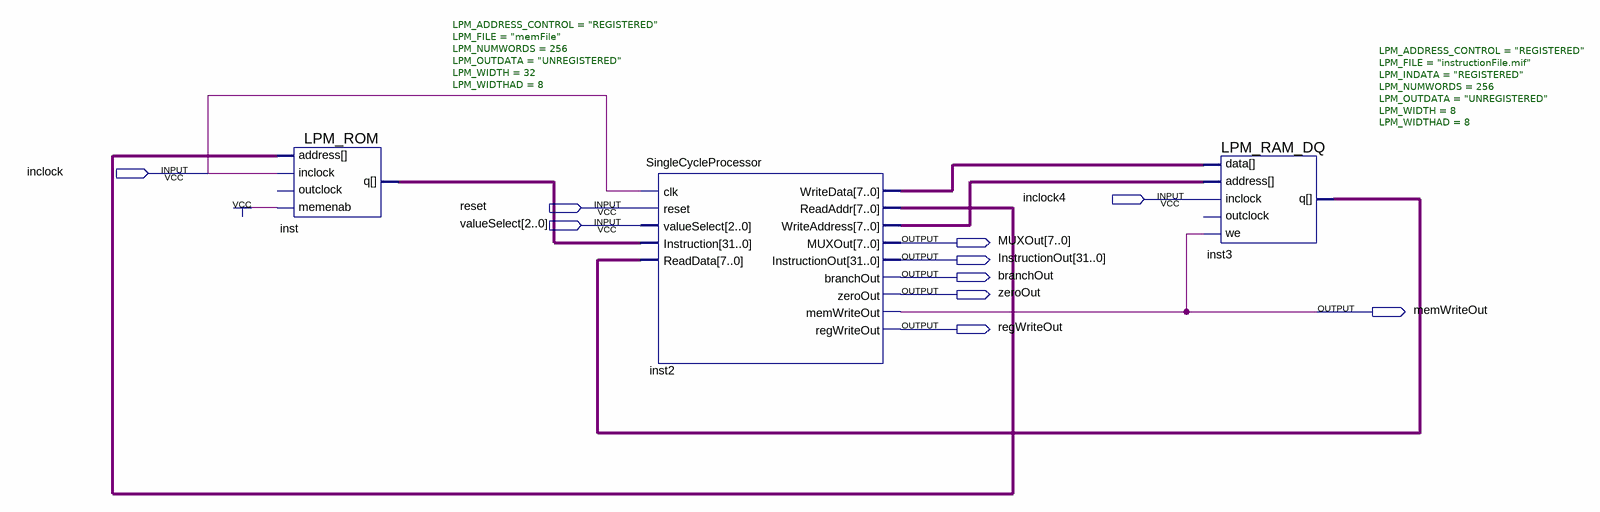
[diagram p0: schematic sheet]
// Quartus schematic SingleCycleMIPS.bdf as structural Verilog: 3 symbols, 10 pins
module SingleCycleMIPS (
  input  inclock,
  input  inclock4,
  input  reset,
  input  [2:0] valueSelect,
  output [7:0] MUXOut,
  output [31:0] InstructionOut,
  output branchOut,
  output zeroOut,
  output memWriteOut,
  output regWriteOut
);

  wire [7:0] inst2_readaddr, inst2_writeaddress, inst2_writedata, inst3_q;
  wire [31:0] inst_q;

  LPM_ROM #(.LPM_ADDRESS_CONTROL("REGISTERED"), .LPM_FILE("memFile"), .LPM_NUMWORDS(256), .LPM_OUTDATA("UNREGISTERED"), .LPM_WIDTH(32), .LPM_WIDTHAD(8)) inst (
    .address(inst2_readaddr), .inclock(inclock), .memenab(1'b1), .q(inst_q));  // open: outclock
  SingleCycleProcessor inst2 (
    .clk(inclock), .reset(reset), .valueSelect(valueSelect), .Instruction(inst_q), .ReadData(inst3_q),
    .WriteData(inst2_writedata), .ReadAddr(inst2_readaddr), .WriteAddress(inst2_writeaddress),
    .MUXOut(MUXOut), .InstructionOut(InstructionOut), .branchOut(branchOut), .zeroOut(zeroOut),
    .memWriteOut(memWriteOut), .regWriteOut(regWriteOut));
  LPM_RAM_DQ #(.LPM_ADDRESS_CONTROL("REGISTERED"), .LPM_FILE("instructionFile.mif"), .LPM_INDATA("REGISTERED"), .LPM_NUMWORDS(256), .LPM_OUTDATA("UNREGISTERED"), .LPM_WIDTH(8), .LPM_WIDTHAD(8)) inst3 (
    .inclock(inclock4), .data(inst2_writedata), .address(inst2_writeaddress), .we(memWriteOut), .q(inst3_q));  // open: outclock
endmodule
